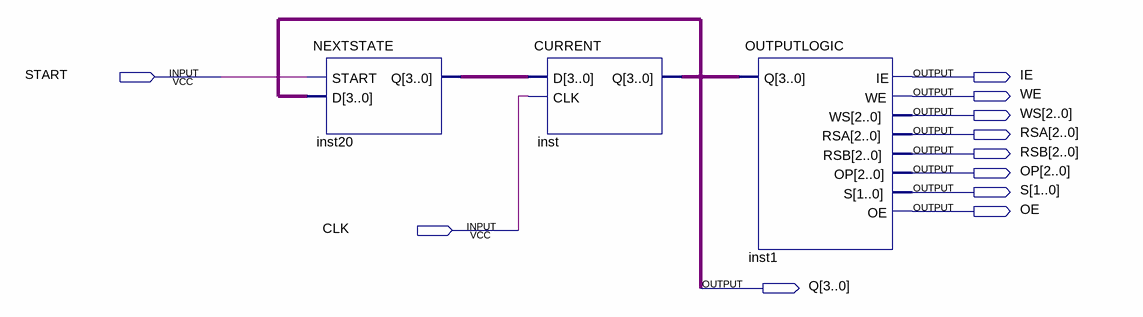
[diagram p0: schematic sheet]
// Quartus schematic CONTROLLER.bdf as structural Verilog: 3 symbols, 11 pins
module CONTROLLER (
  input  START,
  input  CLK,
  output IE,
  output WE,
  output [2:0] WS,
  output [2:0] RSA,
  output [2:0] RSB,
  output [2:0] OP,
  output [1:0] S,
  output OE,
  output [3:0] Q
);

  wire [3:0] inst20_q;

  NEXTSTATE inst20 (.START(START), .D(Q), .Q(inst20_q));
  CURRENT inst (.D(inst20_q), .CLK(CLK), .Q(Q));
  OUTPUTLOGIC inst1 (.Q(Q), .IE(IE), .WE(WE), .WS(WS), .RSA(RSA), .RSB(RSB), .OP(OP), .S(S), .OE(OE));
endmodule
